# EAGLE schematic Laptimer (EAGLE 6.3)
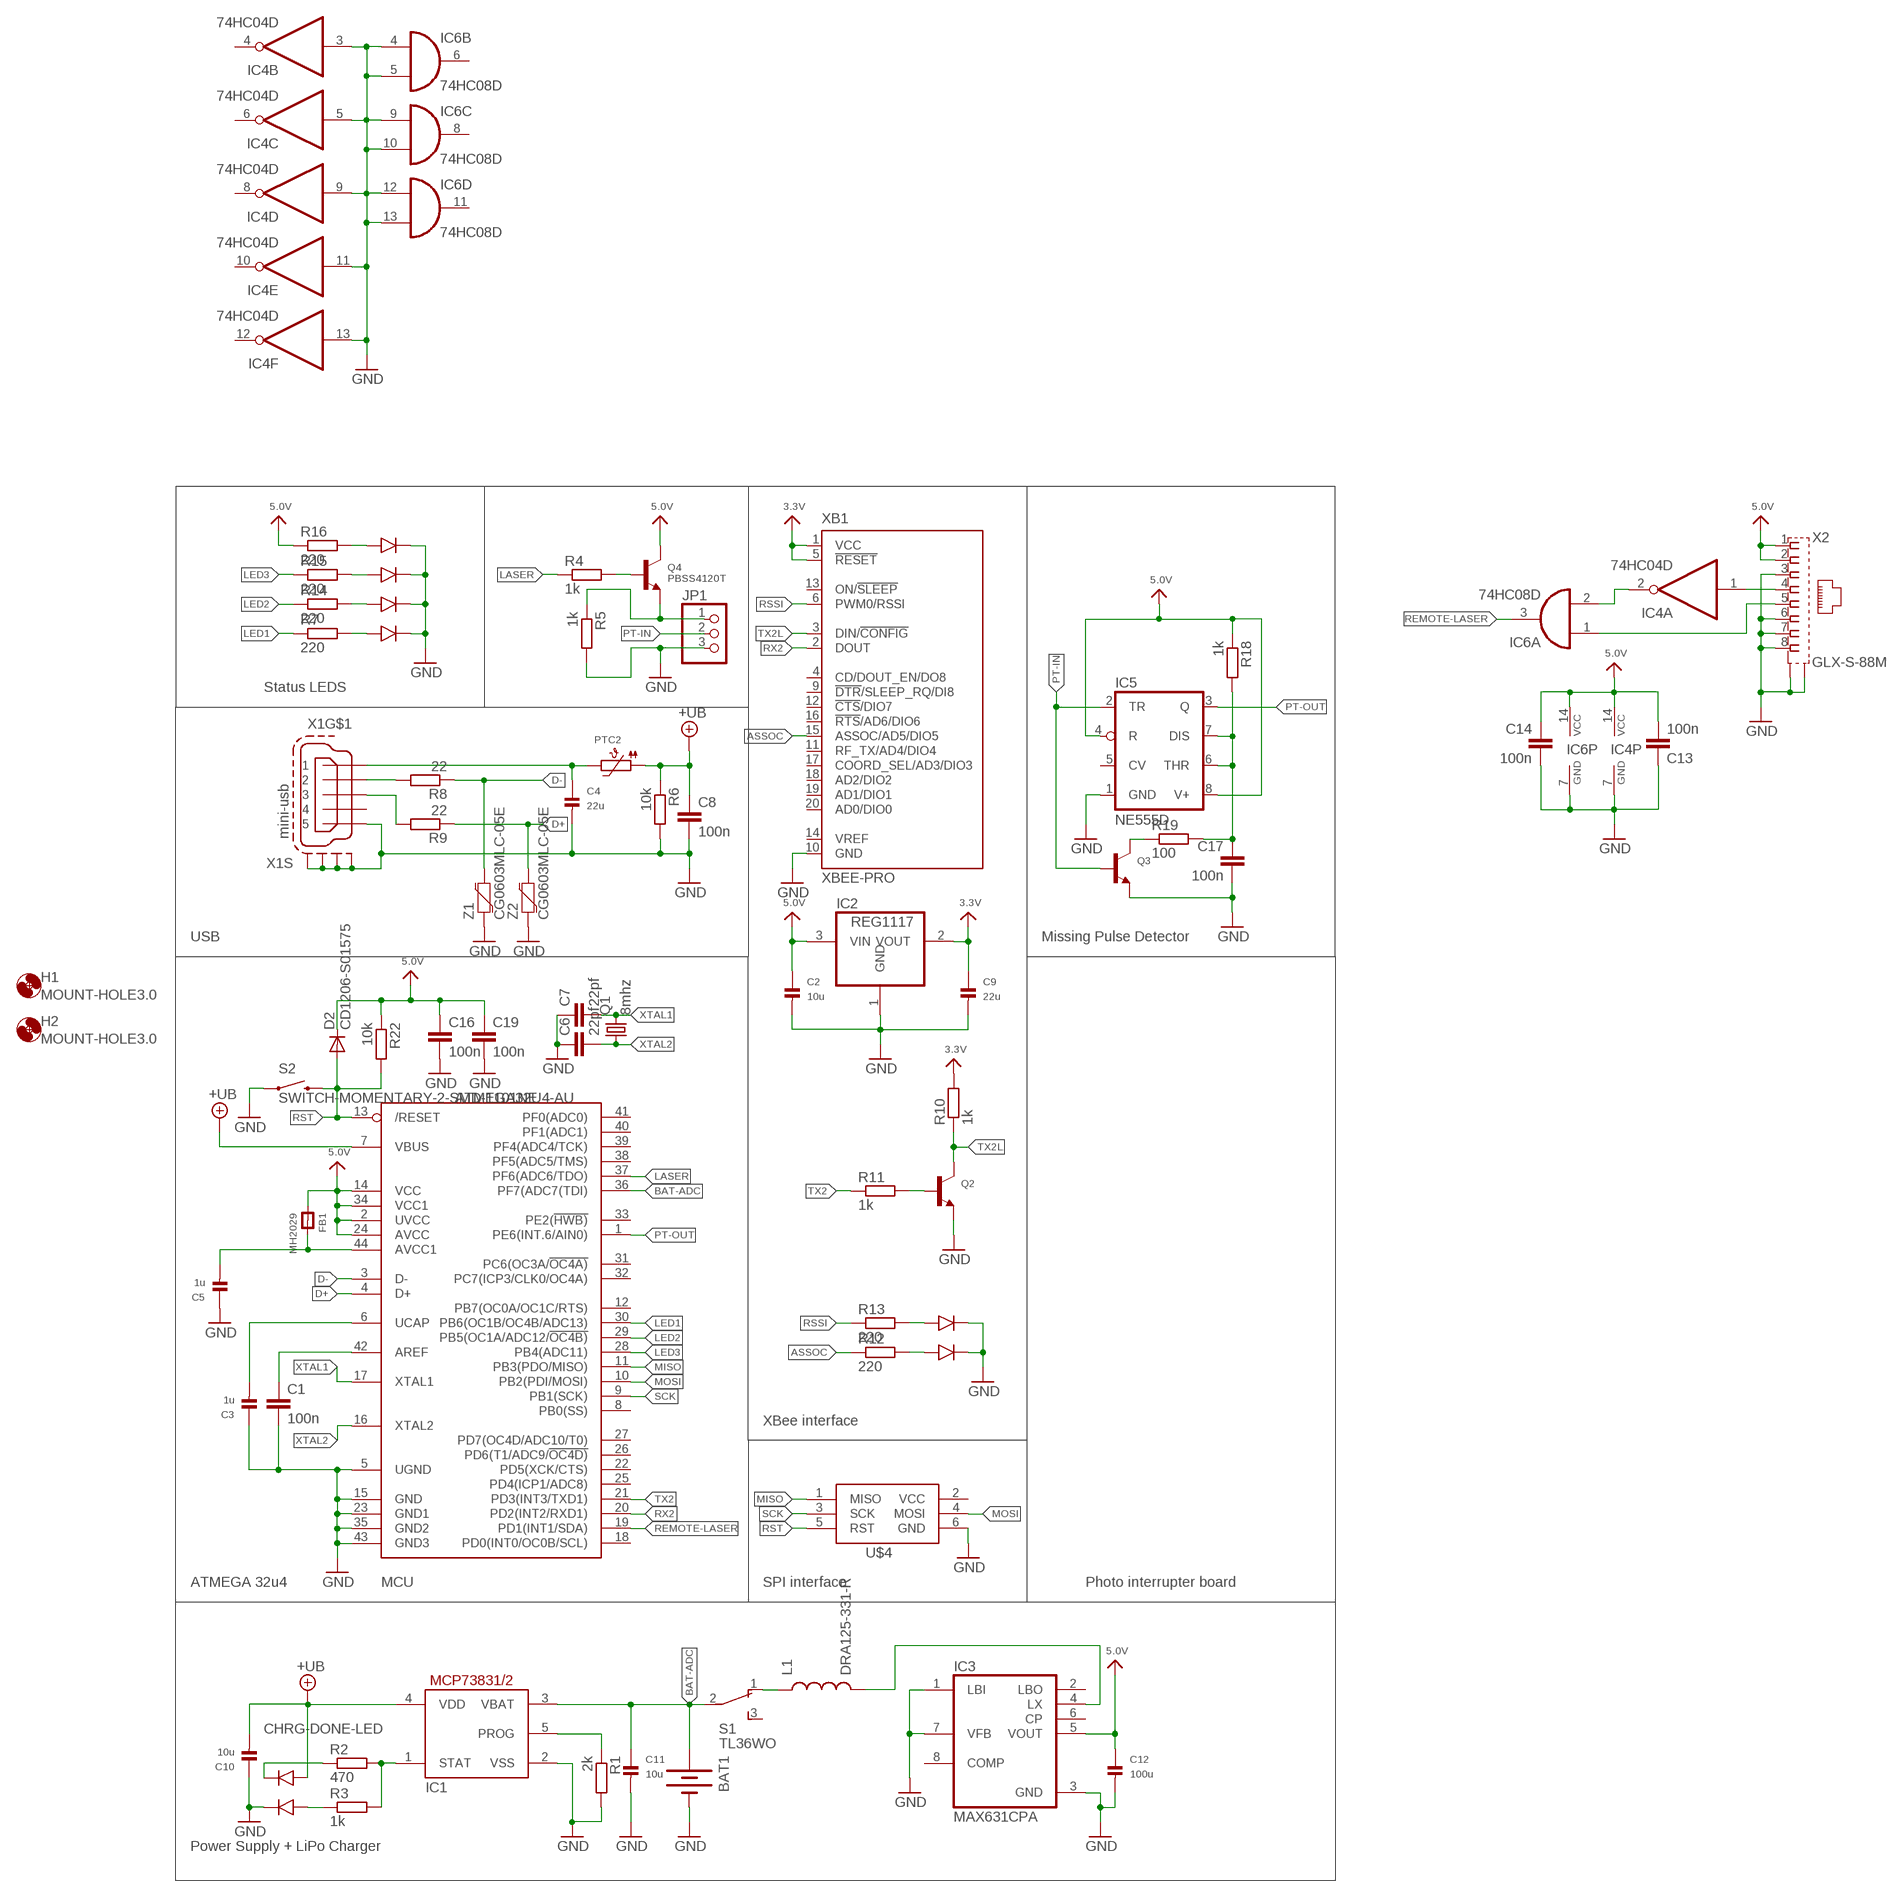
[diagram p0: schematic, sheet 1]

## Parts
BAT1  BATTERY18650  [BATTERY_18650-HOLDER]
C1  100n  C-EUC0603K  [C0603K]
C2  10u  CAP_CERAMIC_0805  [_0805]
C3  1u  CAP_CERAMIC_0805MP  [_0805MP]
C4  22u  CAP_CERAMIC_0805MP  [_0805MP]
C5  1u  CAP_CERAMIC_0805MP  [_0805MP]
C6  22pf  C-EUC0603K  [C0603K]
C7  22pf  C-EUC0603K  [C0603K]
C8  100n  C-EUC0603K  [C0603K]
C9  22u  CAP_CERAMIC_0805  [_0805]
C10  10u  CAP_CERAMIC_0805MP  [_0805MP]
C11  10u  CAP_CERAMIC_0805MP  [_0805MP]
C12  100u  CAP_CERAMIC1206  [1206]
C13  100n  C-EUC0603K  [C0603K]
C14  100n  C-EUC0603K  [C0603K]
C16  100n  C-EUC0603K  [C0603K]
C17  100n  C-EUC0603K  [C0603K]
C19  100n  C-EUC0603K  [C0603K]
D2  CD1206-S01575  DIODE-MINIMELF  [MINIMELF]
FB1  MH2029  FERRITE_0805MP  [_0805MP]
H1  MOUNT-HOLE3.0  [3,0]
H2  MOUNT-HOLE3.0  [3,0]
IC1  MCP73831/OT  [SOT23-5L]
IC2  REG1117  [SOT223]
IC3  MAX631CPA  [DIL08]
IC4  74HC04D  [SO14]
IC5  NE555D  [SO08]
IC6  74HC08D  [SO14]
JP1  PINHD-1X3  [1X03]
L1  DRA125-331-R  INDUCTORPWR  [CDRH125]
MCU  ATMEGA32U4-AU  [TQFP44]
PTC2  PTC1206  [1206]
Q1  8mhz  CRYSTALHC49S  [HC49/S]
Q2  TRANSISTOR_NPNWIDE  [SOT23-WIDE]
Q3  TRANSISTOR_NPNWIDE  [SOT23-WIDE]
Q4  PBSS4120T  TRANSISTOR_NPNWIDE  [SOT23-WIDE]
R1  2k  R-EU_R0603  [R0603]
R2  470  R-EU_R0603  [R0603]
R3  1k  R-EU_R0603  [R0603]
R4  1k  R-EU_R0603  [R0603]
R5  1k  R-EU_R0603  [R0603]
R6  10k  R-EU_R0603  [R0603]
R7  220  R-EU_R0603  [R0603]
R8  22  R-EU_R0603  [R0603]
R9  22  R-EU_R0603  [R0603]
R10  1k  R-EU_R0603  [R0603]
R11  1k  R-EU_R0603  [R0603]
R12  220  R-EU_R0603  [R0603]
R13  220  R-EU_R0603  [R0603]
R14  220  R-EU_R0603  [R0603]
R15  220  R-EU_R0603  [R0603]
R16  220  R-EU_R0603  [R0603]
R18  1k  R-EU_R0603  [R0603]
R19  100  R-EU_R0603  [R0603]
R22  10k  R-EU_R0603  [R0603]
S1  TL36WO  [TL3XWO]
S2  SWITCH-MOMENTARY-2-SMD-1101NE  [TACTILE-SWITCH-1101NE]
U$1  BI-LEVEL-LED-INDICATOR  [BI-LEVEL-LED-INDICATOR]
U$4  AVRISP-BOX  [AVRISP-BOX]
U$11  BI-LEVEL-LED-INDICATOR  [BI-LEVEL-LED-INDICATOR]
U$18  BI-LEVEL-LED-INDICATOR  [BI-LEVEL-LED-INDICATOR]
U$19  BI-LEVEL-LED-INDICATOR  [BI-LEVEL-LED-INDICATOR]
X1  mini-usb  MINI-USB-SCHIELD-32005-301  [32005-301]
X2  GLX-S-88M  [GLX-S-88M]
XB1  XBEE-PRO  [XBEE-PRO]
Z1  CG0603MLC-05E  VARISTOR-0603  [0603-RES]
Z2  CG0603MLC-05E  VARISTOR-0603  [0603-RES]

## Nets
1D+: R9.2 X1.3
1D-: R8.2 X1.2
3.3V: C9.1 IC2.2(VOUT) R10.2 XB1.1(VCC) XB1.5(!RESET)
5.0V: C2.1 C12.1 C13.2 C14.1 C16.1 C19.1 D2.C FB1.1 IC2.3(VIN) IC3.5(VOUT) IC4.14(P:VCC) IC5.4(R) IC5.8(V+) IC6.14(P:VCC) MCU.2(UVCC) MCU.14(VCC) MCU.24(AVCC) MCU.34(VCC1) Q4.3(C) R16.1 R18.1 R22.1 X2.1 X2.2
+UB: C8.1 C10.2 IC1.4(VDD) MCU.7(VBUS) PTC2.1 R6.1 U$1.ANODE1
ASSOC: R12.1 XB1.15(ASSOC/AD5/DIO5)
BAT-ADC: BAT1.PWR@1(+) C11.1 IC1.3(VBAT) MCU.36(PF7(ADC7(TDI)) S1.2(P)
CHRG-DONE-LED: R3.1 U$1.ANODE2
D+: MCU.4(D+) R9.1 Z2.2
D-: MCU.3(D-) R8.1 Z1.2
GND: BAT1.GND@1(-) C1.2 C2.2 C3.1 C4.2 C5.1 C6.1 C7.1 C8.2 C9.2 C10.1 C11.2 C12.2 C13.1 C14.2 C16.2 C17.2 C19.2 IC1.2(VSS) IC2.1(GND) IC3.1(LBI) IC3.3(GND) IC3.7(VFB) IC4.3(B:I) IC4.5(C:I) IC4.7(P:GND) IC4.9(D:I) IC4.11(E:I) IC4.13(F:I) IC5.1(GND) IC6.4(B:I0) IC6.5(B:I1) IC6.7(P:GND) IC6.9(C:I0) IC6.10(C:I1) IC6.12(D:I0) IC6.13(D:I1) JP1.3 MCU.5(UGND) MCU.15(GND) MCU.23(GND1) MCU.35(GND2) MCU.43(GND3) Q2.2(E) Q3.2(E) R1.2 R5.2 R6.2 S2.P$1 U$1.CATHODE2 U$4.6(GND) U$11.CATHODE1 U$11.CATHODE2 U$18.CATHODE1 U$18.CATHODE2 U$19.CATHODE1 U$19.CATHODE2 X1.5 X1.M1(S:S1) X1.M2(S:S2) X1.M3(S:S3) X1.M4(S:S4) X2.3 X2.6 X2.7 X2.8 X2.S1 X2.S2 XB1.10(GND) Z1.1 Z2.1
LASER: MCU.37(PF6(ADC6/TDO)) R4.1
LED1: MCU.30(PB6(OC1B/OC4B/ADC13)) R7.1
LED2: MCU.29(PB5(OC1A/ADC12/!OC4B)) R14.1
LED3: MCU.28(PB4(ADC11)) R15.1
MISO: MCU.11(PB3(PDO/MISO)) U$4.1(MISO)
MOSI: MCU.10(PB2(PDI/MOSI)) U$4.4(MOSI)
N$3: IC1.5(PROG) R1.1
N$4: IC1.1(STAT) R2.2 R3.2
N$5: JP1.1 Q4.2(E) R5.1
N$6: Q4.1(B) R4.2
N$7: C5.2 FB1.2 MCU.44(AVCC1)
N$9: C1.1 MCU.42(AREF)
N$12: C3.2 MCU.6(UCAP)
N$13: C4.1 PTC2.2 X1.1
N$14: R2.1 U$1.CATHODE1
N$15: R7.2 U$18.ANODE1
N$17: R12.2 U$11.ANODE1
N$18: Q2.1(B) R11.2
N$19: R13.2 U$11.ANODE2
N$20: IC4.1(A:I) X2.4
N$21: R14.2 U$18.ANODE2
N$22: IC6.1(A:I0) X2.5
N$24: IC3.4(LX) L1.2
N$25: R15.2 U$19.ANODE1
N$26: L1.1 S1.1(O)
N$28: IC4.2(A:O) IC6.2(A:I1)
N$32: R16.2 U$19.ANODE2
N$36: C17.1 IC5.6(THR) IC5.7(DIS) R18.2 R19.2
N$41: Q3.3(C) R19.1
PT-IN: IC5.2(TR) JP1.2 Q3.1(B)
PT-OUT: IC5.3(Q) MCU.1(PE6(INT.6/AIN0))
REMOTE-LASER: IC6.3(A:O) MCU.19(PD1(INT1/SDA))
RSSI: R13.1 XB1.6(PWM0/RSSI)
RST: D2.A MCU.13(/RESET) R22.2 S2.P$2 U$4.5(RST)
RX2: MCU.20(PD2(INT2/RXD1)) XB1.2(DOUT)
SCK: MCU.9(PB1(SCK)) U$4.3(SCK)
TX2: MCU.21(PD3(INT3/TXD1)) R11.1
TX2L: Q2.3(C) R10.1 XB1.3(DIN/!CONFIG)
XTAL1: C7.2 MCU.17(XTAL1) Q1.2
XTAL2: C6.2 MCU.16(XTAL2) Q1.1
Unconnected: IC3.2(LBO) IC3.6(CP) IC3.8(COMP) IC4.4(B:O) IC4.6(C:O) IC4.8(D:O) IC4.10(E:O) IC4.12(F:O) IC5.5(CV) IC6.6(B:O) IC6.8(C:O) IC6.11(D:O) MCU.8(PB0(SS)) MCU.12(PB7(OC0A/OC1C/RTS)) MCU.18(PD0(INT0/OC0B/SCL)) MCU.22(PD5(XCK/CTS)) MCU.25(PD4(ICP1/ADC8)) MCU.26(PD6(T1/ADC9/!OC4D)) MCU.27(PD7(OC4D/ADC10/T0)) MCU.31(PC6(OC3A/!OC4A)) MCU.32(PC7(ICP3/CLK0/OC4A)) MCU.33(PE2(!HWB)) MCU.38(PF5(ADC5/TMS)) MCU.39(PF4(ADC4/TCK)) MCU.40(PF1(ADC1)) MCU.41(PF0(ADC0)) S1.3(S) X1.4 XB1.4(CD/DOUT_EN/DO8) XB1.9(!DTR!/SLEEP_RQ/DI8) XB1.11(RF_TX/AD4/DIO4) XB1.12(!CTS!/DIO7) XB1.13(ON/!SLEEP) XB1.14(VREF) XB1.16(!RTS!/AD6/DIO6) XB1.17(COORD_SEL/AD3/DIO3) XB1.18(AD2/DIO2) XB1.19(AD1/DIO1) XB1.20(AD0/DIO0)

## Notes on the sheet
- Status LEDS
- USB | Missing Pulse Detector
- XBee interface
- ATMEGA 32u4 | SPI interface | Photo interrupter board
- Power Supply + LiPo Charger

## Power pins joined to a net without a drawn wire
VCC: U$4.2(VCC)

## Library data of the parts
BAT1 = SparkFun-Electromechanical:BATTERY: Battery Holders Various common sizes : AA, AAA, 18650 (PRT-12895), 20mm coin cell and 12mm coin cell. 20MM_4LEGS, BATT-10373
C1 C6-C8 C13 C14 C16 C17 C19 = rcl:C-EU: CAPACITOR, European symbol
C2-C5 C9-C12 = microbuilder:CAP_CERAMIC: Ceramic Capacitors 0402 - 0402 Surface Mount Capacitors 16pF 50V 5% [Digikey: 445-4899-2-ND] 18pF 50V 5% [Digikey: 490-1281-2-ND] 22pF 50V 5% [Digikey: 490-1283-2-ND] 68pF 50V 5% [Digikey: 490-1289-2-ND] 0.1uF 10V 10% [Digikey: 490-1318-2-ND] 1.0uF 6.3V 10% [Digikey: 490-1320-2-ND] 0603 - 0603 Surface Mount Capacitors 16 pF 50V 5% [Digikey: 445-5051-2-ND] 22 pF 50V [Digikey: PCC220ACVTR-ND] 33 pF 50V 5% [Digikey: 490-1415-1-ND] 56pF 50V 5% [Digikey: 490-1421-1-ND] 220pF 50V 5% [Digikey: 445-1285-1-ND] 680 pF 50V 2200 pF 50V 5% C0G [Digikey: 445-1297-1-ND] 5600 pF 100V 5% X7R [Digikey: 478-3711-1-ND] 0.1 µF 25V 10% [Digikey: PCC2277TR-ND] 0.22 µF 16V 10% X7R [Digikey: 445-1318-1-ND] 1.0 µF 25V 10% [Digikey: 445-5146-2-ND] 0603 - RF Specific 3pF 250V +/-0.1pF RF [Digikey: 712-1347-1-ND] 18 pF 250V 5% [Digikey: 478-3505-1-ND or 712-1322-1-ND] 56 pF 250V 5% C0G RF [Digikey: 490-4867-1-ND] 68 pF 250V RF [Digikey: 490-4868-1-ND] 0805 - 0805 Surface Mount Capacitors 220 pF 250V 2% RF Ceramic Capacitor [Digikey: 712-1398-1-ND] 1000 pF 50V 2% NP0 Ceramic Capacitor [Digikey: 478-3760-1-ND] 0.1 µF 25V 10% Ceramic Capacitor [Digikey: PCC1828TR-ND] 1.0 µF 16V 10% Ceramic Capacitor[Digikey: 490-1691-2-ND] 10.0 µF 10V 10% Ceramic Capacitor[Digikey: 709-1228-1-ND] 10.0 uF 16V 10% Ceramic Capacitor [Digikey: 478-5165-2-ND] 47 uF 6.3V 20% Ceramic Capacitor [Digikey: 587-1779-1-ND or 399-5506-1-ND] 1206 - 1206 Surface Mount Capacitors 47uF 10V 20% Ceramic Capacitor [Digikey: 490-5528-1-ND or 399-5508-1-ND or 445-6010-1-ND] 100uF 6.3V -20%, +80% Y5V Ceramic Capacitor (Digikey: 490-4512-1-ND, Mouser: 81-GRM31CF50J107ZE1L)
D2 = diode:DIODE-: DIODE
FB1 = microbuilder:FERRITE: Ferrite Bead 0603 MMZ1608B121C - 120 Ohm @ 100MHz, 600mA, 0.15 Ohm DC Resistance - Digikey: 445-2164-1-ND BK1608HW121-T - 120 Ohm, 600mA Ferrite Chip - Digikey: 587-1876-2-ND 0805 HZ0805B272R-10 - 2.7K Ohm @ 100MHz, 200mA, 0.8 Ohm DC Resistance - Digikey: 240-2504-1-ND (see also Murata BLM21BD272SN1L) MMZ2012Y152B - 1.5K Ohm @ 100MHz, 500mA, 0.4 Ohm DC Resistance - Digikey: 445-1560-1-ND - Mainly for high frequency (80-400MHz) MMZ2012R102A - 1K Ohm @ 100MHz, 500mA, 0.3 Ohm DC Resistance - Digikey: 445-1555-2-ND - More general purpose (10-200MHz)
H1 H2 = holes:MOUNT-HOLE: MOUNTING HOLE with drill center marker
IC1 = adafruit:MCP73831: MCP73831/2 Miniature Single-Cell, Fully Integrated Li-Ion, Li-Polymer Charge Management Controllers. Nice and small simple lipoly charge controller, with adjustable current and status output (LED) http://www.ladyada.net/library/pcb/eaglelibrary.html
IC2 = burr-brown:REG1117: 800mA and 1A Low Dropout (LDO) Positive Regulator 1.8V, 2.5V, 2.85V, 3.3V, 5V, and Adj; MPN: REG1117; OC_FARNELL: 1097566; OC_NEWARK: 14P6981
IC3 = maxim:MAX631CPA: Step-up SWITCHING REGULATOR; OC_FARNELL: unknown; OC_NEWARK: unknown
IC4 = 74xx-eu:74*04: Hex INVERTER
IC5 = linear:*555: TIMER
IC6 = 74xx-eu:74*08: Quad 2-input AND gate
JP1 = adafruit:PINHD-1X3: PIN HEADER
L1 = SparkFun-Passives:INDUCTOR: Inductors Basic Inductor/Choke - 0603 and 1206. Footprints are not proven and vary greatly between part numbers. INDUCTOR POWER 3.3UH 4.0A SMD 0.197" L x 0.197" W x 0.177" H (5.00mm x 5.00mm x 4.50mm)
MCU = adafruit:ATMEGA32U4: http://www.ladyada.net/library/eagle
PTC2 = microbuilder:PTC: PTC (Resettable Fuse) 1206 Package 250mA PTC (16V Max, Time-to-Trip: 0.08s) - Digikey: F2110CT-ND 1210 Package 100mA PTC (30V Max, Time-to-Trip: 0.6s) - Digikey: MF-USMF010-2CT-ND 1812 Package 750mA PTC (24V Max, Time-to-Trip: 0.2s) - Digikey: MF-MSMF075/24-2CT-ND
Q1 = adafruit:CRYSTAL: CRYSTAL; OC_FARNELL: 1667008; OC_NEWARK: unknown
Q2-Q4 = microbuilder:TRANSISTOR_NPN: NPN Transistor Transistor (NPN) 500mA 45V - BC817 [Digikey: 568-1631-1-ND] Transistor (NPN) 500mA 45V - BC817,215 [Mouser: 771-BC817-T/R] SOT23-R - SOT23 footprint optimised for use with solder paste and reflow ovens. SOT23-W - SOT23 footprint optimised for hand-soldering (larger pads).
R1-R16 R18 R19 R22 = rcl:R-EU_: RESISTOR, European symbol
S1 = switch:TL36WO: TINY SWITCH ON - ON Source: http://www2.produktinfo.conrad.com/datenblaetter/700000-724999/705152-da-01-de-Subminiaturschalter_TL_36WO.pdf
S2 = SparkFun-Electromechanical:SWITCH-MOMENTARY-2: Various NO switches- pushbuttons, reed, etc
U$1 U$11 U$18 U$19 = unicorn_v2:BI-LEVEL-LED-INDICATOR
U$4 = adafruit:AVRISP: AVR ISP HEADER Standard 6 pin header for AVR programming
X1 = con-cypressindustries:MINI-USB-SCHIELD-: MINI USB-B Conector Source: www.cypressindustries.com; OC_FARNELL: unknown; OC_NEWARK: unknown
X2 = con-kycon:GLX-S-88M: Mod. Jack, Right Angle, 8 posiotion, 8 contatcs RJ45 Source: GLX-S-88M.pdf; OC_FARNELL: unknown; OC_NEWARK: unknown
XB1 = microbuilder:XBEE: XBee (TM) /XBee-PRO(TM) OEM RF Modules Source: MaxStream, Inc. xbee_productmanual.pdf
Z1 Z2 = SparkFun-DiscreteSemi:VARISTOR: Varistor Varistor (Variable resistor) is a nonlinear resistive element of the voltage dependence that resistance changes with applied voltage. Varistor is equivalent with Zener diode of two series connection.